# EAGLE design bb(v1) (EAGLE 9.6.2)

## Sheet 1 of 2

## Sheet 2 of 2
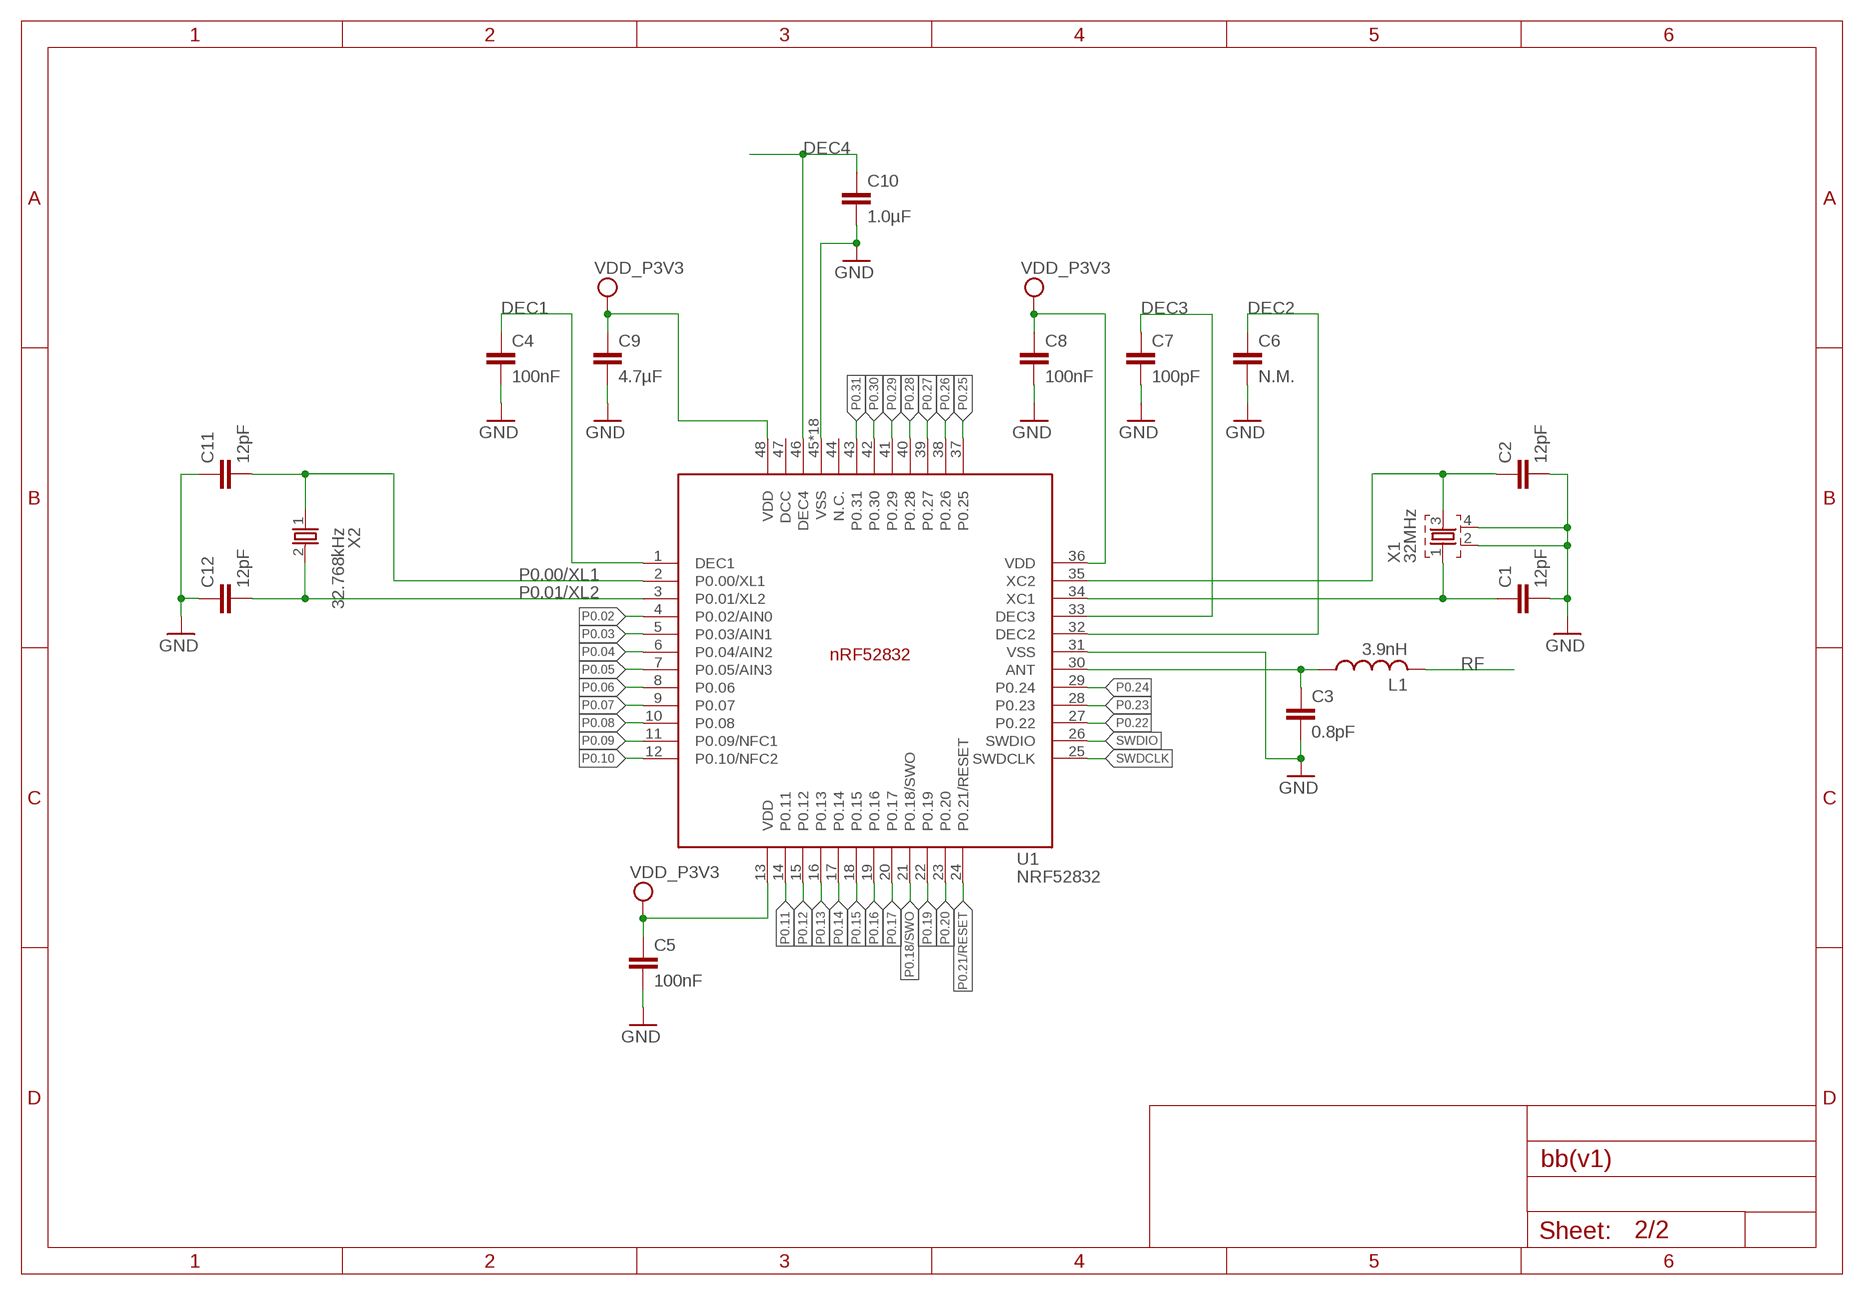
[diagram p0: schematic, sheet 2]

### Parts
C1  12pF  CAPACITOR_0402_N  [RESC0402_N]
C2  12pF  CAPACITOR_0402_N  [RESC0402_N]
C3  0.8pF  CAPACITOR_0402_N  [RESC0402_N]
C4  100nF  CAPACITOR_0402_N  [RESC0402_N]
C5  100nF  CAPACITOR_0402_N  [RESC0402_N]
C6  N.M.  CAPACITOR_0402_N  [RESC0402_N]
C7  100pF  CAPACITOR_0402_N  [RESC0402_N]
C8  100nF  CAPACITOR_0402_N  [RESC0402_N]
C9  4.7µF  CAPACITOR_0603_N  [RESC0603_N]
C10  1.0µF  CAPACITOR_0603_N  [RESC0603_N]
C11  12pF  CAPACITOR_0402_N  [RESC0402_N]
C12  12pF  CAPACITOR_0402_N  [RESC0402_N]
L1  3.9nH  INDUCTOR_0402_N  [RESC0402_N]
U1  NRF52832  [QFN40P600X600X90-48_N]
X1  32MHz  XTAL_32MHZ  [BT-XTAL_2016_N]
X2  32.768kHz  XTAL_32KHZ  [XTAL_3215_N]

### Nets
ANT: C3.1 L1.1 U1.30(ANT)
DEC1: C4.1 U1.1(DEC1)
DEC2: C6.1 U1.32(DEC2)
DEC3: C7.1 U1.33(DEC3)
DEC4: C10.1 U1.46(DEC4)
GND: C1.2 C2.2 C3.2 C4.2 C5.2 C6.2 C7.2 C8.2 C9.2 C10.2 C11.1 C12.1 U1.31(VSS) U1.45(VSS) U1.PAD(VSS) U1.PAD@VIA01(VSS) U1.PAD@VIA02(VSS) U1.PAD@VIA03(VSS) U1.PAD@VIA04(VSS) U1.PAD@VIA05(VSS) U1.PAD@VIA06(VSS) U1.PAD@VIA07(VSS) U1.PAD@VIA08(VSS) U1.PAD@VIA09(VSS) U1.PAD@VIA10(VSS) U1.PAD@VIA11(VSS) U1.PAD@VIA12(VSS) U1.PAD@VIA13(VSS) U1.PAD@VIA14(VSS) U1.PAD@VIA15(VSS) U1.PAD@VIA16(VSS) X1.2 X1.4
N$3: C2.1 U1.35(XC2) X1.3
P0.00/XL1: C11.2 U1.2(P0.00/XL1) X2.1
P0.01/XL2: C12.2 U1.3(P0.01/XL2) X2.2
P0.02: U1.4(P0.02/AIN0)
P0.03: U1.5(P0.03/AIN1)
P0.04: U1.6(P0.04/AIN2)
P0.05: U1.7(P0.05/AIN3)
P0.06: U1.8(P0.06)
P0.07: U1.9(P0.07)
P0.08: U1.10(P0.08)
P0.09: U1.11(P0.09/NFC1)
P0.10: U1.12(P0.10/NFC2)
P0.11: U1.14(P0.11)
P0.12: U1.15(P0.12)
P0.13: U1.16(P0.13)
P0.14: U1.17(P0.14)
P0.15: U1.18(P0.15)
P0.16: U1.19(P0.16)
P0.17: U1.20(P0.17)
P0.18/SWO: U1.21(P0.18/SWO)
P0.19: U1.22(P0.19)
P0.20: U1.23(P0.20)
P0.21/RESET: U1.24(P0.21/RESET)
P0.22: U1.27(P0.22)
P0.23: U1.28(P0.23)
P0.24: U1.29(P0.24)
P0.25: U1.37(P0.25)
P0.26: U1.38(P0.26)
P0.27: U1.39(P0.27)
P0.28: U1.40(P0.28)
P0.29: U1.41(P0.29)
P0.30: U1.42(P0.30)
P0.31: U1.43(P0.31)
RF: L1.2
SWDCLK: U1.25(SWDCLK)
SWDIO: U1.26(SWDIO)
VDD_P3V3: C5.1 C8.1 C9.1 U1.13(VDD) U1.36(VDD) U1.48(VDD)
X1: C1.1 U1.34(XC1) X1.1
Unconnected: U1.44(N.C.) U1.47(DCC)

## Library data of the parts
C1-C12 = Nordic_nRF:CAPACITOR: Generic chip capacitor
L1 = Nordic_nRF:INDUCTOR: Generic chip inductor
U1 = Nordic_nRF:NRF52832: nRF52832 Features Single chip, highly flexible, 2.4 GHz multi-protocol SoC 32-bit ARM Cortex-M4F Processor 1.7v to 3.6v operation 512kB flash + 64kB RAM Supports concurrent Bluetooth Smart/ANT protocol operation On-chip NFC tag for Out-of-Band (OOB) pairing Up to +4dBm output power -96dBm sensitivity, Bluetooth Smart Thread safe and run-time protected Event driven API On air compatible with nRF24L and nRF24AP series 2 data rates (2Mbps/1Mbps) PPI - maximum flexibility for power-efficient applications and code simplification Automated power management system with automatic power management of each peripheral Configurable I/O mapping for analog and digital I/O 3 x Master/Slave SPI 2 x Two-wire interface (I²C) UART (RTS/CTS) 3 x PWM AES HW encryption Real Time Counter (RTC) Digital microphone interface (PDM) On-chip balun Applications Internet of Things (IoT) Wearables SmartHome sensors Connected white goods Computer peripherals Voice-command smart remotes A4WP ‘Rezence’ wireless charging Beacons Sports and fitness sensors and hubs Connected health products Smart watches RC Toys Interactive games Building automation and sensor networks
X1 = Nordic_nRF:XTAL_32MHZ
X2 = Nordic_nRF:XTAL_32KHZ

## Board
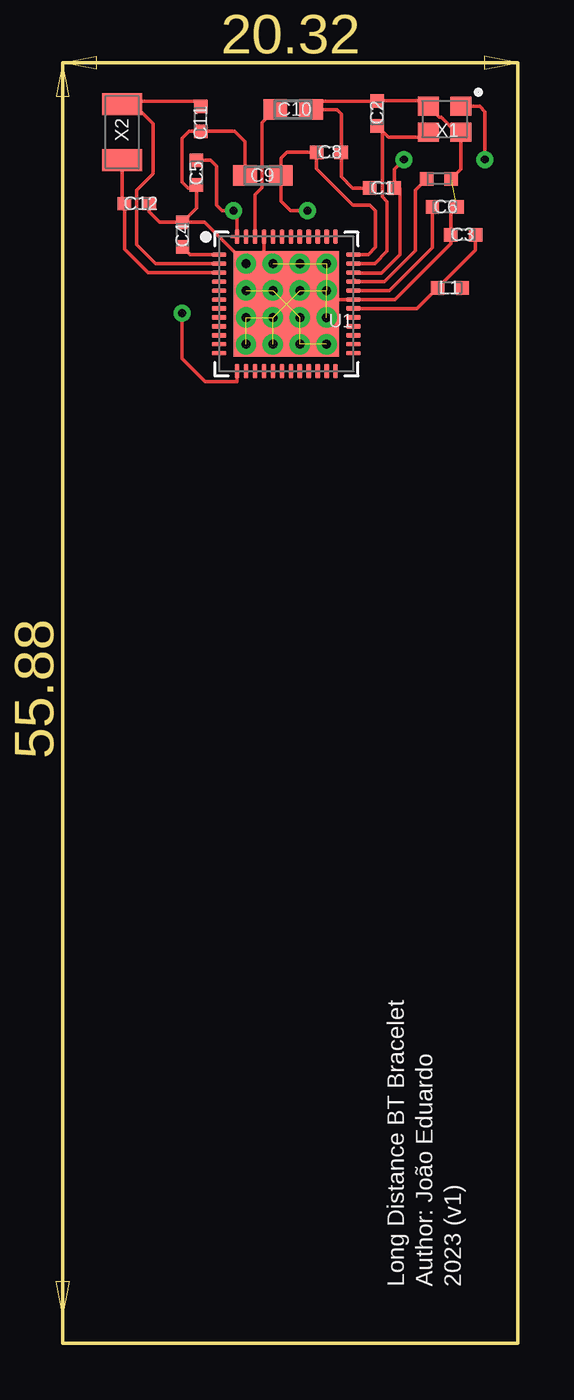
[diagram p1: board, top side]
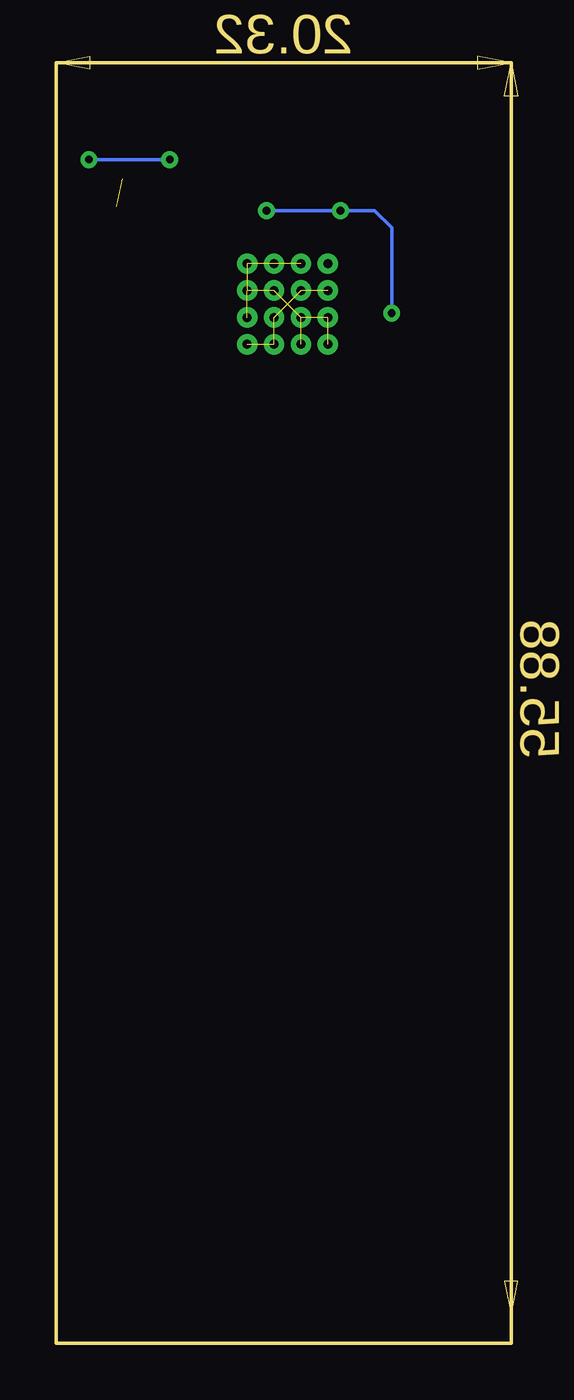
[diagram p2: board, bottom side, seen from below]

Size 20.32 x 57.15 mm. Coordinates in mm from the lower left corner, seen from the top.
Outline: 0,57.15 0,0 20.32,0 20.32,57.15 0,57.15
Copper layers (1*16): Top 0.035mm / dielectric 1.5mm / Bottom 0.035mm
Design rules "default": minimum track width 6mil, minimum drill 0.35mm, track to track 6mil, track to pad 6mil, pad to pad 6mil, via to via 6mil, smd to smd 6mil, copper to edge 40mil, drill to drill 6mil, minimum pad ring 10mil, minimum via ring 8mil, stop-mask expansion 4mil, vias tented up to drill 0mil, thermal gap 10mil

### Footprints (pad centres in the part's own frame; a part is rotated, then mirrored left to right if it is on the bottom)
RESC0402_N = smd 0.6 x 0.6: 1 -0.55,0; 2 0.55,0
RESC0603_N = smd 1.05 x 0.9: 1 -0.8,0; 2 0.8,0
QFN40P600X600X90-48_N = smd 0.65 x 0.2: 1 -3,2.2; 2 -3,1.8; 3 -3,1.4; 4 -3,1; 5 -3,0.6; 6 -3,0.2; 7 -3,-0.2; 8 -3,-0.6; 9 -3,-1; 10 -3,-1.4; 11 -3,-1.8; 12 -3,-2.2; 25 3,-2.2; 26 3,-1.8; 27 3,-1.4; 28 3,-1; 29 3,-0.6; 30 3,-0.2; 31 3,0.2; 32 3,0.6; 33 3,1; 34 3,1.4; 35 3,1.8; 36 3,2.2 | smd 0.2 x 0.65: 13 -2.2,-3; 14 -1.8,-3; 15 -1.4,-3; 16 -1,-3; 17 -0.6,-3; 18 -0.2,-3; 19 0.2,-3; 20 0.6,-3; 21 1,-3; 22 1.4,-3; 23 1.8,-3; 24 2.2,-3; 37 2.2,3; 38 1.8,3; 39 1.4,3; 40 1,3; 41 0.6,3; 42 0.2,3; 43 -0.2,3; 44 -0.6,3; 45 -1,3; 46 -1.4,3; 47 -1.8,3; 48 -2.2,3 | smd 4.7 x 4.7: PAD 0,0 | drill 0.4: PAD@VIA01 -1.8,1.8; PAD@VIA02 -1.8,0.6; PAD@VIA03 -1.8,-0.6; PAD@VIA04 -1.8,-1.8; PAD@VIA05 -0.6,1.8; PAD@VIA06 -0.6,0.6; PAD@VIA07 -0.6,-0.6; PAD@VIA08 -0.6,-1.8; PAD@VIA09 0.6,1.8; PAD@VIA10 0.6,0.6; PAD@VIA11 0.6,-0.6; PAD@VIA12 0.6,-1.8; PAD@VIA13 1.8,1.8; PAD@VIA14 1.8,0.6; PAD@VIA15 1.8,-0.6; PAD@VIA16 1.8,-1.8
BT-XTAL_2016_N = smd 0.95 x 0.85: 1 -0.725,-0.575; 2 0.725,-0.575; 3 0.725,0.575; 4 -0.725,0.575
XTAL_3215_N = smd 1 x 1.8: 1 -1.25,0; 2 1.25,0

### Placement (x,y rotation side)
C1  14.25,51.56 180 top
C2  14.04,54.89 90 top
C3  17.88,49.47 180 top
C4  5.35,49.48 90 top
C5  5.97,52.25 270 top
C6  17.05,50.72 0 top
C7  16.8,51.97 0 top
C8  11.89,53.15 0 top
C9  8.94,52.12 180 top
C10  10.28,55.06 0 top
C11  6.16,54.64 90 top
C12  3.31,50.86 180 top
L1  17.29,47.11 0 top
U1  9.98,46.39 0 top
X1  17.05,54.63 180 top
X2  2.65,54.05 270 top

### Tracks (layer width: path | path; a pad name or v marks a point on that pad's centre or on a via)
ANT
  Top 0.152: U1.30 15.82,46.19 L1.1 18.43,48.79 C3.1
DEC1
  Top 0.152: U1.1 5.7,48.59 C4.1
DEC2
  Top 0.152: C6.1 16.5,48.91 14.59,46.99 U1.32
DEC3
  Top 0.152: 13.05,47.46 U1.33 14.37,47.39 15.75,48.77 15.75,51.47 C7.1
DEC4
  Top 0.152: C10.1 8.89,54.47 8.89,51.57 8.58,51.26 U1.46
GND  (16 unrouted)
  Top 0.152: U1.PAD@VIA14 12.18,46.59 U1.31 14.84,46.59 17.33,49.08 C3.2 17.33,50.44 C6.2 | U1.45 8.98,48.77 | 8.98,48.77 8.98,48.59 U1.PAD@VIA05 | C7.2 17.78,52.4 X1.4 17.55,54.06 16.9,54.71 16.82,54.71 X1.2 16.07,55.46 14.06,55.46 C2.2 11.46,55.44 C10.2 12.25,55.06 12.45,54.86 12.45,53.1 12.44,53.09 C8.2 | C8.2 12.44,52.06 12.94,51.56 C1.2 | 12.44,53.34 C8.2 | C9.2 8.14,53.63 7.68,54.09 C11.1 5.65,54.09 5.33,53.77 5.33,51.82 5.59,51.56 5.97,51.56 | C4.2 4.33,50.03 3.86,50.49 C12.1 | 8.98,48.77 8.4,48.19 U1.PAD@VIA01 | U1.PAD 6.34,50.03 C4.2 | C4.2 5.97,50.65 5.97,51.56 | 5.97,51.56 C5.2
N$3
  Top 0.152: X1.3 16.1,53.83 14.55,53.83 C2.1 14.27,54.11 14.27,51.16 14.48,50.96 14.48,48.74 13.93,48.19 U1.35
P0.00/XL1
  Top 0.152: C11.2 5.9,55.44 2.8,55.44 X2.1 3.16,55.3 4.04,54.43 4.04,52.21 3.3,51.47 3.3,49.02 4.14,48.19 U1.2
P0.01/XL2
  Top 0.152: X2.2 2.65,50.97 C12.2 2.76,48.83 3.81,47.79 U1.3
VDD_P3V3  (via drill 0.35)
  Top 0.152: U1.36 13.64,48.59 13.97,48.91 13.97,50.55 13.72,50.8 12.95,50.8 11.34,52.42 C8.1 | 11.18,53 C8.1 | C8.1 10.01,53.15 9.74,52.88 C9.1 9.74,50.97 10.16,50.55 v10.92,50.55 | C5.1 6.6,52.8 6.86,52.54 6.86,50.8 7.11,50.55 v7.62,50.55 7.78,50.38 U1.48 7.53,49.39 | U1.13 7.78,42.93 6.35,42.93 5.33,43.94 v5.33,45.97
  Bottom 0.152: v5.33,45.97 5.33,49.78 6.1,50.55 v7.62,50.55 v10.92,50.55
X1  (via drill 0.35)
  Top 0.152: U1.34 13.01,47.76 13.18,47.76 13.19,47.75 14.22,47.75 15.05,48.58 15.05,51.56 C1.1 14.8,52.39 v15.24,52.83 | X1.1 18.61,55.21 18.85,54.97 v18.85,52.83
  Bottom 0.152: v15.24,52.83 v18.85,52.83

### Text on the board
tNames: Long Distance BT Bracelet | Author: João Eduardo | 2023 (v1)